# Altium schematic sheet ESP32 and Flash.SchDoc
size A4; SheetNumber: 6; SheetTotal: 7
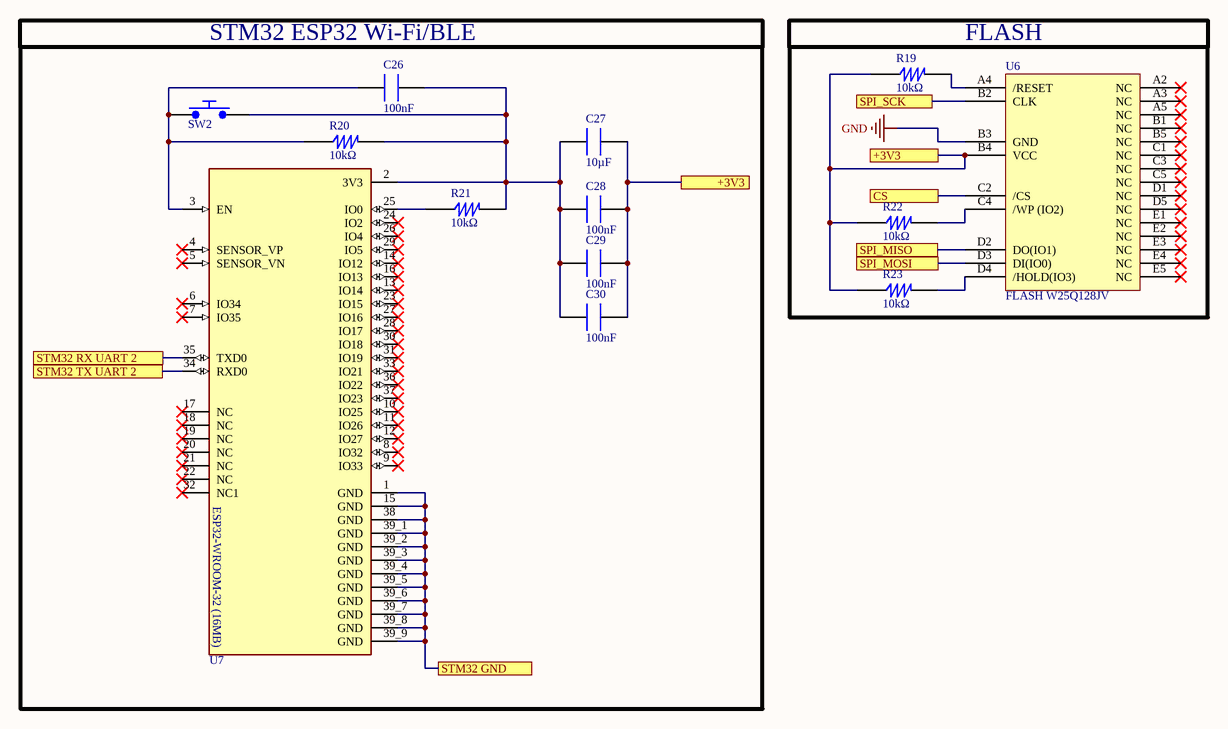
[diagram p0: ESP32 and Flash.SchDoc]

## Parts
C26  value 100nF  [CAP CER 0603]  (hidden comment: KGM15AR70J104JT)
C27  value 10µF  [CAP CER 0805]  (hidden comment: CL21B106KQQNNNG)
C28  value 100nF  [CAP CER 0603]  (hidden comment: KGM15AR70J104JT)
C29  value 100nF  [CAP CER 0603]  (hidden comment: KGM15AR70J104JT)
C30  value 100nF  [CAP CER 0603]  (hidden comment: KGM15AR70J104JT)
R19  value 10kΩ  [RES 0603]  (hidden comment: RMCF0603FT10K0)
R20  value 10kΩ  [RES 0603]  (hidden comment: RMCF0603FT10K0)
R21  value 10kΩ  [RES 0603]  (hidden comment: RMCF0603FT10K0)
R22  value 10kΩ  [RES 0603]  (hidden comment: RMCF0603FT10K0)
R23  value 10kΩ  [RES 0603]  (hidden comment: RMCF0603FT10K0)
SW2  PTS636SM50JSMTR LFS  [SWITCH TACTILE]  (value not drawn)
U6  W25Q128JVBJM  [24-TFBGA (6x8)]  (value not drawn)
U7  ESP32-WROOM-32 (16MB)  [ESP32-WROOM-32 (16MB)]  (value not drawn)

## Blocks framed on the sheet
STM32 ESP32 Wi-Fi/BLE: C26-C30 R20 R21 SW2 U7
FLASH: R19 R22 R23 U6

## Ports
+3V3 (see COM[1C], COM[3C], COM[3D], COM[4B], ESP32 and Flash[2A], MCU[2A], MCU[2B], MCU[3A], MCU[3B], MCU[3D], Power[3B], Power[4A]), +3V3 (see COM[1C], COM[3C], COM[3D], COM[4B], ESP32 and Flash[3A], MCU[2A], MCU[2B], MCU[3A], MCU[3B], MCU[3D], Power[3B], Power[4A]), CS (see MCU[3C]), SPI_MISO (see MCU[3C]), SPI_MOSI (see MCU[3B]), SPI_SCK (see MCU[3C]), STM32 GND (see COM[1B], COM[1D], COM[2C], COM[2D], COM[3B], COM[4D], MCU[3A], MCU[3D], MCU[4B], Power[1C], Power[2B]), STM32 RX UART 2 (see MCU[2C]), STM32 TX UART 2 (see MCU[2C])

## Nets
GND: U6.B3(GND)
+3V3: C27.2 C28.2 C29.2 C30.2 R19.1 R22.1 R23.1 U6.B4(VCC) ; port +3V3
CS: U6.C2(/CS) ; port CS
SPI_MISO: U6.D2(DO(IO1)) ; port SPI_MISO
SPI_MOSI: U6.D3(DI(IO0)) ; port SPI_MOSI
SPI_SCK: U6.B2(CLK) ; port SPI_SCK
STM32 GND: U7.1(GND) U7.15(GND) U7.38(GND) U7.39_1(GND) U7.39_2(GND) U7.39_3(GND) U7.39_4(GND) U7.39_5(GND) U7.39_6(GND) U7.39_7(GND) U7.39_8(GND) U7.39_9(GND) ; port STM32 GND
STM32 RX UART 2: U7.35(TXD0) ; port STM32 RX UART 2
STM32 TX UART 2: U7.34(RXD0) ; port STM32 TX UART 2
NetC26_1: C26.1 R20.1 SW2.1 U7.3(EN)
NetC26_2: C26.2 C27.1 C28.1 C29.1 C30.1 R20.2 R21.2 SW2.2 U7.2(3V3)
NetR19_2: R19.2 U6.A4(/RESET)
NetR21_1: R21.1 U7.25(IO0)
NetR22_2: R22.2 U6.C4(/WP_(IO2))
NetR23_2: R23.2 U6.D4(/HOLD(IO3))

Not connected (* = marked no-connect by the designer): U6 A2(NC)* A3(NC)* A5(NC)* B1(NC)* B5(NC)* C1(NC)* C3(NC)* C5(NC)* D1(NC)* D5(NC)* E1(NC)* E2(NC)* E3(NC)* E4(NC)* E5(NC)*; U7 4(SENSOR_VP)* 5(SENSOR_VN)* 6(IO34)* 7(IO35)* 8(IO32)* 9(IO33)* 10(IO25)* 11(IO26)* 12(IO27)* 13(IO14)* 14(IO12)* 16(IO13)* 17(NC)* 18(NC)* 19(NC)* 20(NC)* 21(NC)* 22(NC)* 23(IO15)* 24(IO2)* 26(IO4)* 27(IO16)* 28(IO17)* 29(IO5)* 30(IO18)* 31(IO19)* 32(NC1)* 33(IO21)* 36(IO22)* 37(IO23)*

## Library data of the parts
C26 C28-C30 = CAP CER 0.1UF 6.3V 0603: 0.1 µF ±5% 6.3V Ceramic Capacitor X7R 0603 (1608 Metric); Manufacturer: KYOCERA AVX; Supplier: Arrow Electronics; Supplier Part Number: KGM15AR70J104JT; Manufacturer Part Number: KGM15AR70J104JT; RoHS: Compliant; Category: Ceramic Capacitors; Stock: 2087; Pricing: 1=0,019, 10=0,019, 25=0,019, 100=0,018, 250=0,018, 500=0,018, 1000=0,018 (USD); Dielectric Material: Ceramic; Height: 900µm; Length: 1.6mm; Lifecycle Status: Production; Max Operating Temperature: 125°C; Min Operating Temperature: -55°C; Mounting Technology: Surface Mount; Number of Terminals: 2; REACH SVHC: Yes; Voltage Rating (DC): 6.3V; Width: 810µm; ComponentLink1URL: https://datasheet.octopart.com:443/KGM15AR70J104JT-KYOCERA-AVX-datasheet-179280988.pdf?src-supplier=IHS; ComponentLink1Description: https://datasheet.octopart.com:443/KGM15AR70J104JT-KYOCERA-AVX-datasheet-179280988.pdf?src-supplier=IHS
C27 = CAP CER 10UF 6.3V 0805: 10 µF ±10% 6.3V Ceramic Capacitor X7R 0805 (2012 Metric); Manufacturer: Samsung Electro-Mechanics; Supplier: Arrow Electronics; Supplier Part Number: CL21B106KQQNNNG; Manufacturer Part Number: CL21B106KQQNNNG; RoHS: Compliant; Category: Ceramic Capacitors; Stock: 330626; Pricing: 1=0,0256, 10=0,011, 25=0,011, 100=0,008, 250=0,008, 500=0,007, 1000=0,006, 3000=0,006, 6000=0,005, 15000=0,005, 30000=0,005, 75000=0,004, 150000=0,004 (USD); Case/Package: 0805; Case Code (Imperial): 0805; Case Code (Metric): 2012; China RoHS: Compliant; Depth: 1.25mm; Dielectric: X7R; Dielectric Material: Ceramic; Height: 1.4mm; Lead Free: Lead Free; Length: 2mm; Lifecycle Status: Production; Material: Ceramic; Max Operating Temperature: 125°C; Min Operating Temperature: -55°C; Mounting Technology: Surface Mount; Number of Terminals: 2; REACH SVHC: Yes; Schedule B: 8532240020, 8532240020|8532240020, 8532240020|8532240020|8532240020, 8532240020|8532240020|8532240020|8532240020; Thickness: 1.397mm; Tolerance: 10%; Voltage: 6.3V; Voltage Rating: 6.3V; Voltage Rating (DC): 6.3V; Width: 1.25mm; ComponentLink1URL: https://datasheet.octopart.com:443/CL21B106KQQNNNG-Samsung-Electro-Mechanics-datasheet-182023452.pdf?src-supplier=IHS; ComponentLink1Description: https://datasheet.octopart.com:443/CL21B106KQQNNNG-Samsung-Electro-Mechanics-datasheet-182023452.pdf?src-supplier=IHS; ComponentLink2URL: https://datasheet.octopart.com:443/CL21B106KQQNNNG-Samsung-Electro-Mechanics-datasheet-136482505.pdf?src-supplier=Samsung+SCT; ComponentLink2Description: https://datasheet.octopart.com:443/CL21B106KQQNNNG-Samsung-Electro-Mechanics-datasheet-136482505.pdf?src-supplier=Samsung+SCT; ComponentLink3URL: https://datasheet.octopart.com:443/CL21B106KQQNNNG-Samsung-Electro-Mechanics-datasheet-116891051.pdf?src-supplier=Future+Electronics; ComponentLink3Description: https://datasheet.octopart.com:443/CL21B106KQQNNNG-Samsung-Electro-Mechanics-datasheet-116891051.pdf?src-supplier=Future+Electronics; ComponentLink4URL: https://datasheet.octopart.com:443/CL21B106KQQNNNG-Samsung-Electro-Mechanics-datasheet-81462194.pdf?src-supplier=Future+Electronics; ComponentLink4Description: https://datasheet.octopart.com:443/CL21B106KQQNNNG-Samsung-Electro-Mechanics-datasheet-81462194.pdf?src-supplier=Future+Electronics; ComponentLink5URL: https://datasheet.octopart.com:443/CL21B106KQQNNNG-Samsung-datasheet-26669288.pdf?src-supplier=Future+Electronics; ComponentLink5Description: https://datasheet.octopart.com:443/CL21B106KQQNNNG-Samsung-datasheet-26669288.pdf?src-supplier=Future+Electronics; ComponentLink6URL: https://datasheet.octopart.com:443/CL21B106KQQNNNG-Samsung-datasheet-8324245.pdf?src-supplier=Future+Electronics; ComponentLink6Description: https://datasheet.octopart.com:443/CL21B106KQQNNNG-Samsung-datasheet-8324245.pdf?src-supplier=Future+Electronics; ComponentLink7URL: https://datasheet.octopart.com:443/CL21B106KQQNNNG-Samsung-Electro-Mechanics-datasheet-149045989.pdf?src-supplier=Future+Electronics; ComponentLink7Description: https://datasheet.octopart.com:443/CL21B106KQQNNNG-Samsung-Electro-Mechanics-datasheet-149045989.pdf?src-supplier=Future+Electronics; ComponentLink8URL: https://datasheet.octopart.com:443/CL21B106KQQNNNG-Samsung-datasheet-37081328.pdf?src-supplier=Future+Electronics; ComponentLink8Description: https://datasheet.octopart.com:443/CL21B106KQQNNNG-Samsung-datasheet-37081328.pdf?src-supplier=Future+Electronics; ComponentLink9URL: https://datasheet.octopart.com/CL21B106KQQNNNG-Samsung-Electro-Mechanics-datasheet-97040617.pdf; ComponentLink9Description: https://datasheet.octopart.com/CL21B106KQQNNNG-Samsung-Electro-Mechanics-datasheet-97040617.pdf; ComponentLink10URL: https://datasheet.octopart.com:443/CL21B106KQQNNNG-Samsung-datasheet-59220082.pdf?src-supplier=TME; ComponentLink10Description: https://datasheet.octopart.com:443/CL21B106KQQNNNG-Samsung-datasheet-59220082.pdf?src-supplier=TME
R19-R23 = RES 10K OHM 1/10W 0603: RES 10K OHM 1% 1/10W 0603; Manufacturer: Stackpole Electronics; Max Power Dissipation: 100mW; Temperature Coefficient: 100ppm/°C; Voltage Rating: 75V; Supplier: Arrow Electronics; Supplier Part Number: RMCF0603FT10K0; Manufacturer Part Number: RMCF0603FT10K0; RoHS: Compliant; Category: Chip SMD Resistors; Stock: 2390000; Pricing: 50000=0,0018 (USD); Case/Package: 0603; Case Code (Imperial): 0603; Case Code (Metric): 1608; China RoHS: Non-Compliant; Composition: Thick Film; Contact Plating: Tin; Depth: 800µm; Features: Automotive AEC-Q200; Height: 450µm; Lead Free: Lead Free; Length: 1.55mm; Lifecycle Status: Production; Max Operating Temperature: 155°C; Military Standard: Not; Min Operating Temperature: -55°C; Mounting Technology: Surface Mount; Number of Terminals: 2; Number of Terminations: 2; Packaging: Cut Tape (CT); Power Dissipation: 100mW; Power Rating: 100mW; Radiation Hardening: No; REACH SVHC: Yes; Schedule B: 8533210045, 8533210045|8533210045, 8533210045|8533210045|8533210045, 8533210045|8533210045|8533210045|8533210045; Tolerance: 1%; Width: 800µm; Working Voltage: 75V; ComponentLink1URL: https://datasheet.octopart.com:443/RMCF0603FT10K0-Stackpole-Electronics-datasheet-182148065.pdf?src-supplier=IHS; ComponentLink1Description: https://datasheet.octopart.com:443/RMCF0603FT10K0-Stackpole-Electronics-datasheet-182148065.pdf?src-supplier=IHS; ComponentLink2URL: https://datasheet.octopart.com:443/RMCF0603FT10K0-Stackpole-Electronics-datasheet-28504820.pdf?src-supplier=Upverter; ComponentLink2Description: https://datasheet.octopart.com:443/RMCF0603FT10K0-Stackpole-Electronics-datasheet-28504820.pdf?src-supplier=Upverter; ComponentLink3URL: https://datasheet.octopart.com:443/RMCF0603FT10K0-Stackpole-Electronics-datasheet-141193804.pdf?src-supplier=Stackpole+Electronics; ComponentLink3Description: https://datasheet.octopart.com:443/RMCF0603FT10K0-Stackpole-Electronics-datasheet-141193804.pdf?src-supplier=Stackpole+Electronics; ComponentLink4URL: https://datasheet.octopart.com:443/RMCF0603FT10K0-Stackpole-Electronics-datasheet-62091608.pdf?src-supplier=Stackpole+Electronics; ComponentLink4Description: https://datasheet.octopart.com:443/RMCF0603FT10K0-Stackpole-Electronics-datasheet-62091608.pdf?src-supplier=Stackpole+Electronics; ComponentLink5URL: https://datasheet.octopart.com:443/RMCF0603FT10K0-Stackpole-Electronics-datasheet-12534581.pdf?src-supplier=Stackpole+Electronics; ComponentLink5Description: https://datasheet.octopart.com:443/RMCF0603FT10K0-Stackpole-Electronics-datasheet-12534581.pdf?src-supplier=Stackpole+Electronics; ComponentLink6URL: https://datasheet.octopart.com:443/RMCF0603FT10K0-Stackpole-Electronics-datasheet-10788263.pdf?src-supplier=Stackpole+Electronics; ComponentLink6Description: https://datasheet.octopart.com:443/RMCF0603FT10K0-Stackpole-Electronics-datasheet-10788263.pdf?src-supplier=Stackpole+Electronics; ComponentLink7URL: https://datasheet.octopart.com:443/RMCF0603FT10K0-Stackpole-Electronics-datasheet-155966809.pdf?src-supplier=Electro+Sonic; ComponentLink7Description: https://datasheet.octopart.com:443/RMCF0603FT10K0-Stackpole-Electronics-datasheet-155966809.pdf?src-supplier=Electro+Sonic; ComponentLink8URL: https://datasheet.octopart.com:443/RMCF0603FT10K0-Stackpole-Electronics-datasheet-189104164.pdf?src-supplier=Master+Electronics; ComponentLink8Description: https://datasheet.octopart.com:443/RMCF0603FT10K0-Stackpole-Electronics-datasheet-189104164.pdf?src-supplier=Master+Electronics; ComponentLink9URL: https://datasheet.octopart.com:443/RMCF0603FT10K0-Stackpole-Electronics-datasheet-154799224.pdf?src-supplier=Master+Electronics; ComponentLink9Description: https://datasheet.octopart.com:443/RMCF0603FT10K0-Stackpole-Electronics-datasheet-154799224.pdf?src-supplier=Master+Electronics; ComponentLink10URL: https://datasheet.octopart.com:443/RMCF0603FT10K0-Stackpole-Electronics-datasheet-11546843.pdf?src-supplier=Arrow+Electronics; ComponentLink10Description: https://datasheet.octopart.com:443/RMCF0603FT10K0-Stackpole-Electronics-datasheet-11546843.pdf?src-supplier=Arrow+Electronics; ComponentLink11URL: https://datasheet.octopart.com:443/RMCF0603FT10K0-Stackpole-Electronics-datasheet-11547379.pdf?src-supplier=Future+Electronics; ComponentLink11Description: https://datasheet.octopart.com:443/RMCF0603FT10K0-Stackpole-Electronics-datasheet-11547379.pdf?src-supplier=Future+Electronics; ComponentLink12URL: https://datasheet.octopart.com:443/RMCF0603FT10K0-Stackpole-Electronics-datasheet-8359789.pdf?src-supplier=Future+Electronics; ComponentLink12Description: https://datasheet.octopart.com:443/RMCF0603FT10K0-Stackpole-Electronics-datasheet-8359789.pdf?src-supplier=Future+Electronics; ComponentLink13URL: https://datasheet.octopart.com:443/RMCF0603FT10K0-Stackpole-Electronics-datasheet-8324226.pdf?src-supplier=Future+Electronics; ComponentLink13Description: https://datasheet.octopart.com:443/RMCF0603FT10K0-Stackpole-Electronics-datasheet-8324226.pdf?src-supplier=Future+Electronics; ComponentLink14URL: http://sigma.octopart.com:80/15940719/materials_sheet/Stackpole-Electronics-RMCF0603FT10K0.pdf?src-supplier=Compliance+Statements; ComponentLink14Description: http://sigma.octopart.com:80/15940719/materials_sheet/Stackpole-Electronics-RMCF0603FT10K0.pdf?src-supplier=Compliance+Statements; ComponentLink15URL: http://sigma.octopart.com:80/141158211/reach_statement/Stackpole-Electronics-RMCF0603FT10K0.pdf?src-supplier=Compliance+Statements; ComponentLink15Description: http://sigma.octopart.com:80/141158211/reach_statement/Stackpole-Electronics-RMCF0603FT10K0.pdf?src-supplier=Compliance+Statements; ComponentLink16URL: http://sigma.octopart.com:80/141158212/rohs_statement/Stackpole-Electronics-RMCF0603FT10K0.pdf?src-supplier=Compliance+Statements; ComponentLink16Description: http://sigma.octopart.com:80/141158212/rohs_statement/Stackpole-Electronics-RMCF0603FT10K0.pdf?src-supplier=Compliance+Statements
SW2 = SWITCH TACTILE 0.05A 12V: Switch Tactile Spst-no 0.05A 12V; Manufacturer: C&K Components; Contact Resistance: 100mΩ; Number of Positions: 2; Supplier: Mouser; Supplier Part Number: 611-PTS636SM50JSMTRL; Manufacturer Part Number: PTS636SM50JSMTR LFS; Category: Tactile Switches; Stock: 6250; Pricing: 1=0,21, 10=0,183, 50=0,172, 100=0,155, 1000=0,123, 10000=0,112 (USD); ComponentLink1URL: https://datasheet.octopart.com:443/PTS636SM50JSMTR-LFS-C%26K-Components-datasheet-166147775.pdf?src-supplier=TME; ComponentLink1Description: https://datasheet.octopart.com:443/PTS636SM50JSMTR-LFS-C%26K-Components-datasheet-166147775.pdf?src-supplier=TME
U6 = FLASH W25Q128JV: FLASH - NOR Memory IC 128Mbit SPI - Quad I/O, QPI, DTR 133 MHz 24-TFBGA (6x8); Memory Type: Non-Volatile; Memory Organization: 16M x 8; Clock Frequency: 133 MHz; Write Cycle Time - Word, Page: 3ms; Voltage - Supply: 2.7V ~ 3.6V; Memory Format: FLASH; Technology: FLASH - NOR; Memory Size: 128Mbit; Memory Interface: SPI - Quad I/O, QPI, DTR; Operating Temperature: -40°C ~ 105°C (TA); Mounting Type: Surface Mount; Package / Case: 24-TBGA; ComponentLink1Description: Datasheet; ComponentLink1URL: https://www.winbond.com/resource-files/w25q128jv_dtr%20revc%2003272018%20plus.pdf; ComponentLink2Description: Supplier Link; ComponentLink2URL: https://www.digikey.com/en/products/detail/winbond-electronics/w25q128jvbjm/9169933; Base Product Number: FLASH W25Q128JV
U7 = ESP32-WROOM-32 (16MB): Bluetooth, WiFi 802.11b/g/n, Bluetooth v4.2 +EDR, Class 1, 2 and 3 Transceiver Module 2.4GHz ~ 2.5GHz Integrated, Chip Surface Mount; Manufacturer: Espressif Systems; Manufacturer Part Number: ESP32-WROOM-32E-N4; Max Supply Voltage: 3.6V; Min Supply Voltage: 3V; Operating Supply Voltage: 3.3V; Supplier: Mouser; Supplier Part Number: 356-ESP32WRM32E132PH; RoHS: Compliant; Category: System on Chip (SoC); Stock: 37962; Pricing: 1=5,59, 1=4,81, 10=5, 10=4,3, 25=3,41, 50=3,96, 100=3,82, 100=3,29, 250=3,17, 650=2,85, 1000=3,31, 1300=2,71, 1950=2,58, 10000=3 (USD); Height - Seated (Max): 3.25mm; Length: 25.5mm; Max Operating Temperature: 85°C; Min Operating Temperature: -40°C; Number of Terminals: 38; Terminal Pitch: 1.27mm; Width: 18mm; ComponentLink1URL: https://datasheet.octopart.com:443/ESP32-WROOM-32E-N4-Espressif-Systems-datasheet-182247776.pdf?src-supplier=IHS; ComponentLink1Description: https://datasheet.octopart.com:443/ESP32-WROOM-32E-N4-Espressif-Systems-datasheet-182247776.pdf?src-supplier=IHS; ComponentLink2URL: https://datasheet.octopart.com:443/ESP32-WROOM-32E-N4-Espressif-Systems-datasheet-188867343.pdf?src-supplier=TME; ComponentLink2Description: https://datasheet.octopart.com:443/ESP32-WROOM-32E-N4-Espressif-Systems-datasheet-188867343.pdf?src-supplier=TME; ComponentLink3URL: https://datasheet.octopart.com:443/ESP32-WROOM-32E-N4-Espressif-Systems-datasheet-165560559.pdf?src-supplier=TME; ComponentLink3Description: https://datasheet.octopart.com:443/ESP32-WROOM-32E-N4-Espressif-Systems-datasheet-165560559.pdf?src-supplier=TME; ComponentLink4URL: https://datasheet.octopart.com:443/ESP32-WROOM-32E-N4-Espressif-Systems-datasheet-151884363.pdf?src-supplier=Future+Electronics; ComponentLink4Description: https://datasheet.octopart.com:443/ESP32-WROOM-32E-N4-Espressif-Systems-datasheet-151884363.pdf?src-supplier=Future+Electronics